# Altium schematic sheet MCU.SchDoc
size Letter; DrawnBy: Titan Yuan; DocumentNumber: 7; SheetNumber: 7; SheetTotal: 7
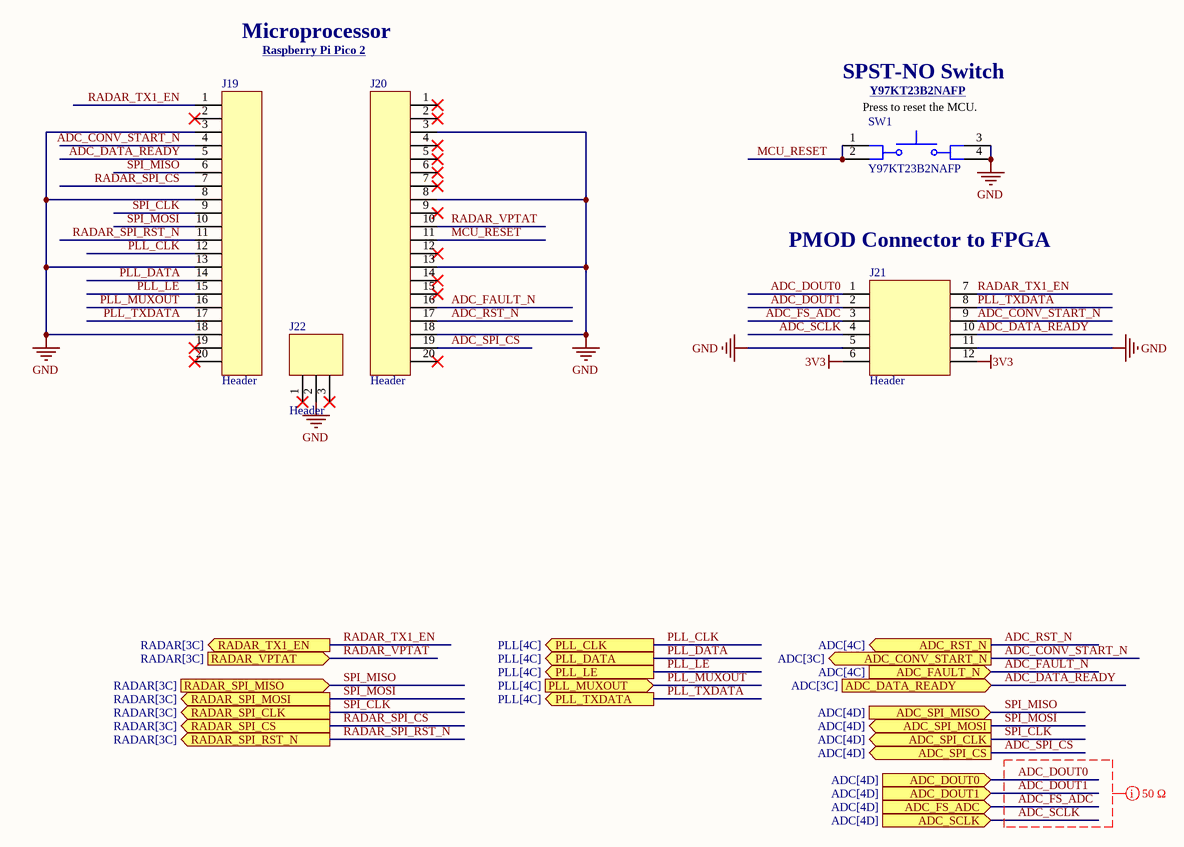
[diagram p0: MCU.SchDoc]

## Parts
J19  Header  [CONN_1x20_2.54mm_PinSocket_Vertical]
J20  Header  [CONN_1x20_2.54mm_PinSocket_Vertical]
J21  Header  [CONN_2x6_2.54mm_PinHeader_Horizontal]
J22  Header  [CONN_1x3_2.54mm_PinSocket_Vertical]
SW1  Y97KT23B2NAFP  [PTS647]

## Ports
ADC_CONV_START_N (out, see ADC[3C]), ADC_DATA_READY (in, see ADC[3C]), ADC_DOUT0 (in, see ADC[4D]), ADC_DOUT1 (in, see ADC[4D]), ADC_FAULT_N (in, see ADC[4C]), ADC_FS_ADC (in, see ADC[4D]), ADC_RST_N (out, see ADC[4C]), ADC_SCLK (in, see ADC[4D]), ADC_SPI_CLK (out, see ADC[4D]), ADC_SPI_CS (out, see ADC[4D]), ADC_SPI_MISO (in, see ADC[4D]), ADC_SPI_MOSI (out, see ADC[4D]), PLL_CLK (out, see PLL[4C]), PLL_DATA (out, see PLL[4C]), PLL_LE (out, see PLL[4C]), PLL_MUXOUT (in, see PLL[4C]), PLL_TXDATA (out, see PLL[4C]), RADAR_SPI_CLK (out, see RADAR[3C]), RADAR_SPI_CS (out, see RADAR[3C]), RADAR_SPI_MISO (in, see RADAR[3C]), RADAR_SPI_MOSI (out, see RADAR[3C]), RADAR_SPI_RST_N (out, see RADAR[3C]), RADAR_TX1_EN (out, see RADAR[3C]), RADAR_VPTAT (in, see RADAR[3C])

## Nets
3V3: J21.6 J21.12
GND: J19.3 J19.8 J19.13 J19.18 J20.3 J20.8 J20.13 J20.18 J21.5 J21.11 J22.2 SW1.3 SW1.4
ADC_CONV_START_N: J19.4 J21.9 ; port ADC_CONV_START_N
ADC_DATA_READY: J19.5 J21.10 ; port ADC_DATA_READY
ADC_DOUT0: J21.1 ; port ADC_DOUT0
ADC_DOUT1: J21.2 ; port ADC_DOUT1
ADC_FAULT_N: J20.16 ; port ADC_FAULT_N
ADC_FS_ADC: J21.3 ; port ADC_FS_ADC
ADC_RST_N: J20.17 ; port ADC_RST_N
ADC_SCLK: J21.4 ; port ADC_SCLK
ADC_SPI_CS: J20.19 ; port ADC_SPI_CS
MCU_RESET: J20.11 SW1.1 SW1.2
PLL_CLK: J19.12 ; port PLL_CLK
PLL_DATA: J19.14 ; port PLL_DATA
PLL_LE: J19.15 ; port PLL_LE
PLL_MUXOUT: J19.16 ; port PLL_MUXOUT
PLL_TXDATA: J19.17 J21.8 ; port PLL_TXDATA
RADAR_SPI_CS: J19.7 ; port RADAR_SPI_CS
RADAR_SPI_RST_N: J19.11 ; port RADAR_SPI_RST_N
RADAR_TX1_EN: J19.1 J21.7 ; port RADAR_TX1_EN
RADAR_VPTAT: J20.10 ; port RADAR_VPTAT
SPI_CLK: J19.9 ; port RADAR_SPI_CLK, port ADC_SPI_CLK
SPI_MISO: J19.6 ; port RADAR_SPI_MISO, port ADC_SPI_MISO
SPI_MOSI: J19.10 ; port RADAR_SPI_MOSI, port ADC_SPI_MOSI

Not connected (* = marked no-connect by the designer): J19 2* 19* 20*; J20 1* 2* 4* 5* 6* 7* 9* 12* 14* 15* 20*; J22 1* 3*

## Layout directives
net class 50 Ω: ADC_DOUT0, ADC_DOUT1, ADC_FS_ADC, ADC_SCLK

## Notes on the sheet
- Microprocessor
- Raspberry Pi Pico 2 <https://www.raspberrypi.com/products/raspberry-pi-pico-2/>
- SPST-NO Switch
- (near SW1) Press to reset the MCU.
- (near SW1) Y97KT23B2NAFP <https://www.ckswitches.com/media/2567/pts647.pdf>
- (near J21) PMOD Connector to FPGA

## Library data of the parts
J19 J20 = CONN_1x20_2.54mm_PinSocket_Vertical: WR-PHD 2.54 mm Socket Header; 20 pins; Manufacturer: Wurth Elektronik; Manufacturer Part Number: 61302011821; Contact Resistance: 20mΩ; Current Rating: 3A; Gender: Female; Insulation Resistance: 1GΩ; Operating Supply Voltage: 250V; Pitch: 2.54mm; Supplier: DigiKey; Supplier Part Number: 732-61302011821-ND; RoHS: Compliant; Category: Connectors; Stock: 9205; Pricing: 1=0.83, 25=0.7508, 100=0.7038, 250=0.6534, 500=0.6048, 1000=0.5058 (USD); Contact Plating: Gold; Insulation Material: PBT; Lead Pitch: 2.54mm; Length: 51.3mm; Max Operating Temperature: 105°C; Min Operating Temperature: -40°C; Pins: 20; Orientation: Vertical; ComponentLink1URL: https://datasheet.octopart.com:443/61302011821-Wurth-Elektronik-datasheet-182028588.pdf?src-supplier=Wurth+Elektronik; ComponentLink1Description: https://datasheet.octopart.com:443/61302011821-Wurth-Elektronik-datasheet-182028588.pdf?src-supplier=Wurth+Elektronik; ComponentLink2URL: https://datasheet.octopart.com:443/61302011821-W%C3%BCrth-Elektronik-datasheet-62127820.pdf?src-supplier=Wurth+Elektronik; ComponentLink2Description: https://datasheet.octopart.com:443/61302011821-W%C3%BCrth-Elektronik-datasheet-62127820.pdf?src-supplier=Wurth+Elektronik; ComponentLink3URL: https://datasheet.octopart.com:443/61302011821-W%C3%BCrth-Elektronik-datasheet-149524182.pdf?src-supplier=Farnell; ComponentLink3Description: https://datasheet.octopart.com:443/61302011821-W%C3%BCrth-Elektronik-datasheet-149524182.pdf?src-supplier=Farnell
J21 = CONN_2x6_2.54mm_PinHeader_Horizontal: Conn Unshrouded Header HDR 12 POS 2.54mm Solder RA Top Entry Thru-Hole Bag; Manufacturer: Adam Tech; Manufacturer Part Number: PH2RA-12-UA; Contact Resistance: 20mΩ; Current Rating: 3A; Insulation Resistance: 5GΩ; Supplier: DigiKey; Supplier Part Number: 2057-PH2RA-12-UA-ND; RoHS: Compliant; Category: Card Edge Connectors; Stock: 5214; Pricing: 1=0.27, 10=0.229, 100=0.1945, 500=0.17358, 1000=0.16528, 5000=0.14753, 10000=0.14049 (USD); Contact Gender: Male; Contact Material: Brass; Export Control Classification Number (ECCN) Code: EAR99; Harmonized Tariff Schedule (HTS) Code: 8536.69.40.40; Introduction Date: 2012-01-13; Lifecycle Status: Production; Max Operating Temperature: 105°C; Min Operating Temperature: -40°C; Pins: 12; Number of Rows: 2; REACH SVHC: Yes; Row Spacing: 2.54mm; Schedule B: 8536694040, 8536694040|8536694040|8536694040|8536694040|8536694040; Terminal Pitch: 2.54mm; ComponentLink1URL: https://datasheet.octopart.com:443/PH2RA-12-UA-Adam-Tech-datasheet-21182894.pdf?src-supplier=IHS; ComponentLink1Description: https://datasheet.octopart.com:443/PH2RA-12-UA-Adam-Tech-datasheet-21182894.pdf?src-supplier=IHS; ComponentLink2URL: http://sigma.octopart.com:80/reach_statement/Adam-Tech-company-23.pdf?src-supplier=Compliance+Statements; ComponentLink2Description: http://sigma.octopart.com:80/reach_statement/Adam-Tech-company-23.pdf?src-supplier=Compliance+Statements; ComponentLink3URL: http://sigma.octopart.com:80/rohs_statement/Adam-Tech-company-22.pdf?src-supplier=Compliance+Statements; ComponentLink3Description: http://sigma.octopart.com:80/rohs_statement/Adam-Tech-company-22.pdf?src-supplier=Compliance+Statements
J22 = CONN_1x3_2.54mm_PinSocket_Vertical: Btb Conn, Rcpt, 3Pos, 1Row, 2.54Mm Rohs Compliant: Yes |Wurth Elektronik 61300311821; Contact Resistance: 20mΩ; Current Rating: 3A; Gender: Female; Insulation Resistance: 1GΩ; Operating Supply Voltage: 250V; Manufacturer: Wurth Elektronik; Manufacturer Part Number: 61300311821; Supplier: DigiKey; Supplier Part Number: 732-61300311821-ND; RoHS: Compliant; Category: Uncategorized; Stock: 1715; Pricing: 1=0.32, 10=0.303, 100=0.2916, 250=0.27992, 500=0.2673 (USD); Contact Plating: Gold; Insulation Material: PBT; Lead Pitch: 2.54mm; Length: 8.12mm; Max Operating Temperature: 105°C; Min Operating Temperature: -40°C; Pins: 3; Orientation: Vertical; Pitch: 2.54mm; ComponentLink1URL: https://datasheet.octopart.com:443/61300311821-Wurth-Elektronik-datasheet-182028583.pdf?src-supplier=Wurth+Elektronik; ComponentLink1Description: https://datasheet.octopart.com:443/61300311821-Wurth-Elektronik-datasheet-182028583.pdf?src-supplier=Wurth+Elektronik; ComponentLink2URL: https://datasheet.octopart.com:443/61300311821-W%C3%BCrth-Elektronik-datasheet-62127820.pdf?src-supplier=Wurth+Elektronik; ComponentLink2Description: https://datasheet.octopart.com:443/61300311821-W%C3%BCrth-Elektronik-datasheet-62127820.pdf?src-supplier=Wurth+Elektronik
SW1 = Y97KT23B2NAFP: Switch Tactile OFF Mom SPST Round Button Gull Wing 50mA 12VDC 100000Cycles 1.77N Surface Mount T/R; Manufacturer: C&K; Bounce Time: <=5 ms; Contact Resistance: 100 mΩ; Electrical Life: 100kcycles; Max Voltage Rating (DC): 12V; Number of Positions: 1; Operating Force: 2.26N; Manufacturer Part Number: Y97KT23B2NAFP; Maximum Voltage: 12 VDC; Maximum Current: 50 mA; Insulation Resistance: 100 MΩ; Supplier: DigiKey; Supplier Part Number: 108-PTS647SM38SMTR2LFSCT-ND; RoHS: Compliant; Category: Tactile Switches; Stock: 37245; Pricing: 1=0.26, 10=0.226, 25=0.2116, 100=0.1897, 250=0.17588, 500=0.16596, 1000=0.15666 (USD); Contact Current Rating: 50mA; Country of Origin: Mainland China; Export Control Classification Number (ECCN) Code: EAR99; Height: 2.9mm; Harmonized Tariff Schedule (HTS) Code: 8536.50.90.40; Introduction Date: 2019-06-11; Length: 4.5mm; Life (Cycles): 100kcycles; Lifecycle Status: Production; Max Current Rating: 50mA; Max Operating Temperature: 70°C; Min Operating Temperature: -40°C; Mounting Technology: Surface Mount; REACH SVHC: Yes; Schedule B: 8536509065, 8536509065|8536509065, 8536509065|8536509065|8536509065, 8536509065|8536509065|8536509065|8536509065; Throw Configuration: SPST; Voltage Rating (DC): 12V; ComponentLink1URL: https://datasheet.octopart.com:443/PTS647SM38SMTR2LFS-C%26K-Components-datasheet-180017464.pdf?src-supplier=IHS; ComponentLink1Description: https://datasheet.octopart.com:443/PTS647SM38SMTR2LFS-C%26K-Components-datasheet-180017464.pdf?src-supplier=IHS; ComponentLink2URL: https://datasheet.octopart.com:443/PTS647SM38SMTR2LFS-C%26K-Components-datasheet-117317067.pdf?src-supplier=Future+Electronics; ComponentLink2Description: https://datasheet.octopart.com:443/PTS647SM38SMTR2LFS-C%26K-Components-datasheet-117317067.pdf?src-supplier=Future+Electronics; ComponentLink3URL: https://datasheet.octopart.com:443/PTS647SM38SMTR2-LFS-C%26K-Components-datasheet-175422368.pdf?src-supplier=Farnell; ComponentLink3Description: https://datasheet.octopart.com:443/PTS647SM38SMTR2-LFS-C%26K-Components-datasheet-175422368.pdf?src-supplier=Farnell; ComponentLink4URL: https://datasheet.octopart.com:443/PTS647SM38SMTR2LFS-C%26K-Components-datasheet-145017121.pdf?src-supplier=Electro+Sonic; ComponentLink4Description: https://datasheet.octopart.com:443/PTS647SM38SMTR2LFS-C%26K-Components-datasheet-145017121.pdf?src-supplier=Electro+Sonic; ComponentLink5URL: https://datasheet.octopart.com:443/PTS-647-SM38-SMTR2-LFS-C%26K-Components-datasheet-119449707.pdf?src-supplier=RS+(Formerly+Allied+Electronics); ComponentLink5Description: https://datasheet.octopart.com:443/PTS-647-SM38-SMTR2-LFS-C%26K-Components-datasheet-119449707.pdf?src-supplier=RS+(Formerly+Allied+Electronics)